# EAGLE design dbt-mini-shield (EAGLE 9.7.0)
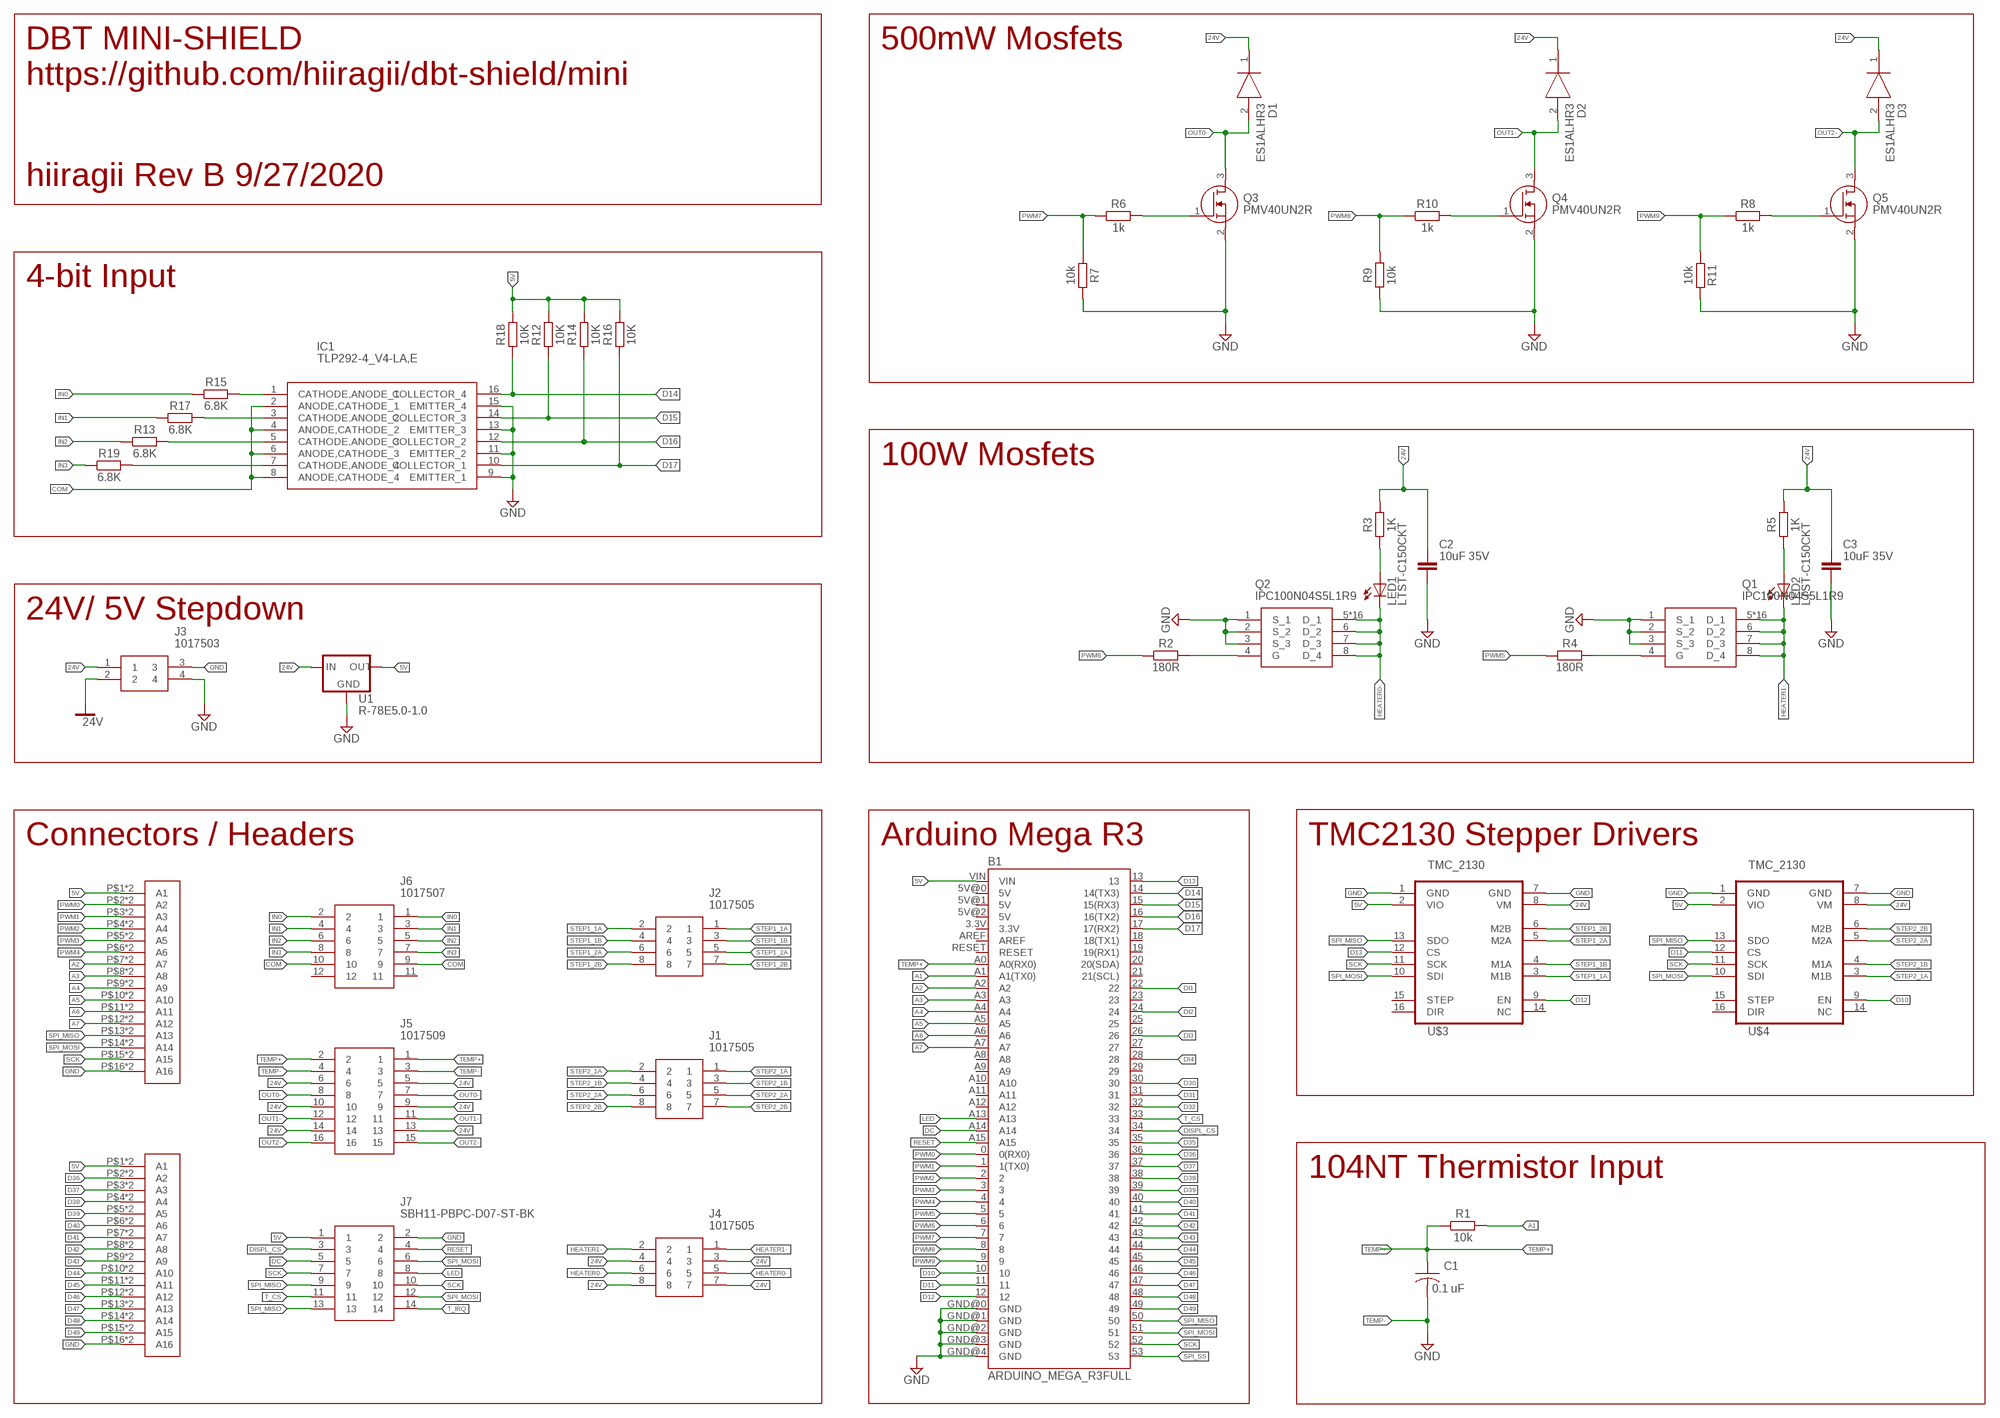
[diagram p0: schematic, sheet 1]

## Parts
B1  ARDUINO_MEGA_R3FULL  [ARDUINO_MEGA]
C1  0.1 uF  C-USC1206  [C1206]
C2  10uF 35V  C_CHIP-1206(3216-METRIC)  [CAPC3216X135]
C3  10uF 35V  C_CHIP-1206(3216-METRIC)  [CAPC3216X135]
D1  ES1ALHR3  [SODFL3618X143N]
D2  ES1ALHR3  [SODFL3618X143N]
D3  ES1ALHR3  [SODFL3618X143N]
IC1  TLP292-4_V4-LA,E  [SOIC127P700X230-16N]
J1  1017505  [1017505]
J2  1017505  [1017505]
J3  1017503  [1017503]
J4  1017505  [1017505]
J5  1017509  [1017509]
J6  1017507  [1017507]
J7  SBH11-PBPC-D07-ST-BK  [SHDR14W64P254_2X7_2528X910X910]
LED1  LTST-C150CKT  LEDCHIPLED_1206  [CHIPLED_1206]
LED2  LTST-C150CKT  LEDCHIPLED_1206  [CHIPLED_1206]
Q1  IPC100N04S5L1R9  [PG-TDSON-8]
Q2  IPC100N04S5L1R9  [PG-TDSON-8]
Q3  PMV40UN2R  [SOT95P230X110-3N]
Q4  PMV40UN2R  [SOT95P230X110-3N]
Q5  PMV40UN2R  [SOT95P230X110-3N]
R1  10k  R_CHIP-1206(3216-METRIC)  [RESC3216X70]
R2  180R  R_CHIP-1206(3216-METRIC)  [RESC3216X70]
R3  1K  R_CHIP-1206(3216-METRIC)  [RESC3216X70]
R4  180R  R_CHIP-1206(3216-METRIC)  [RESC3216X70]
R5  1K  R_CHIP-1206(3216-METRIC)  [RESC3216X70]
R6  1k  R_CHIP-1206(3216-METRIC)  [RESC3216X70]
R7  10k  R_CHIP-1206(3216-METRIC)  [RESC3216X70]
R8  1k  R_CHIP-1206(3216-METRIC)  [RESC3216X70]
R9  10k  R_CHIP-1206(3216-METRIC)  [RESC3216X70]
R10  1k  R_CHIP-1206(3216-METRIC)  [RESC3216X70]
R11  10k  R_CHIP-1206(3216-METRIC)  [RESC3216X70]
R12  10K  R_CHIP-1206(3216-METRIC)  [RESC3216X70]
R13  6.8K  R_CHIP-1206(3216-METRIC)  [RESC3216X70]
R14  10K  R_CHIP-1206(3216-METRIC)  [RESC3216X70]
R15  6.8K  R_CHIP-1206(3216-METRIC)  [RESC3216X70]
R16  10K  R_CHIP-1206(3216-METRIC)  [RESC3216X70]
R17  6.8K  R_CHIP-1206(3216-METRIC)  [RESC3216X70]
R18  10K  R_CHIP-1206(3216-METRIC)  [RESC3216X70]
R19  6.8K  R_CHIP-1206(3216-METRIC)  [RESC3216X70]
U1  R-78E5.0-1.0  [DC-DC_CONVERTER_78XX]
U$1  1861991  [1861991]
U$2  1861991  [1861991]
U$3  TMC_2130  [TMC_2130]
U$4  TMC_2130  [TMC_2130]

## Nets
5V: B1.VIN J7.1 R12.2 R14.2 R16.2 R18.2 U1.VOUT(OUT) U$1.P$1(A1) U$1.P$17(A1) U$2.P$1(A1) U$2.P$17(A1) U$3.2(VIO) U$4.2(VIO)
24V: C2.1 C3.1 D1.1(K) D2.1(K) D3.1(K) J3.1 J3.2 J4.3 J4.4 J4.7 J4.8 J5.5 J5.6 J5.9 J5.10 J5.13 J5.14 R3.2 R5.2 U1.VIN(IN) U$3.8(VM) U$4.8(VM)
A1: B1.A1(A1(TX0)) R1.2
A2: B1.A2 U$1.P$7(A7) U$1.P$23(A7)
A3: B1.A3 U$1.P$8(A8) U$1.P$24(A8)
A4: B1.A4 U$1.P$9(A9) U$1.P$25(A9)
A5: B1.A5 U$1.P$10(A10) U$1.P$26(A10)
A6: B1.A6 U$1.P$11(A11) U$1.P$27(A11)
A7: B1.A7 U$1.P$12(A12) U$1.P$28(A12)
COM: IC1.2(ANODE,CATHODE_1) IC1.4(ANODE,CATHODE_2) IC1.6(ANODE,CATHODE_3) IC1.8(ANODE,CATHODE_4) J6.9 J6.10
D10: B1.10 U$4.9(EN)
D11: B1.11 U$4.12(CS)
D12: B1.12 U$3.9(EN)
D13: B1.13 U$3.12(CS)
D14: B1.14(14(TX3)) IC1.16(COLLECTOR_4) R18.1
D15: B1.15(15(RX3)) IC1.14(COLLECTOR_3) R12.1
D16: B1.16(16(TX2)) IC1.12(COLLECTOR_2) R14.1
D17: B1.17(17(RX2)) IC1.10(COLLECTOR_1) R16.1
D30: B1.30
D31: B1.31
D32: B1.32
D35: B1.35
D36: B1.36 U$2.P$2(A2) U$2.P$18(A2)
D37: B1.37 U$2.P$3(A3) U$2.P$19(A3)
D38: B1.38 U$2.P$4(A4) U$2.P$20(A4)
D39: B1.39 U$2.P$5(A5) U$2.P$21(A5)
D40: B1.40 U$2.P$6(A6) U$2.P$22(A6)
D41: B1.41 U$2.P$7(A7) U$2.P$23(A7)
D42: B1.42 U$2.P$8(A8) U$2.P$24(A8)
D43: B1.43 U$2.P$9(A9) U$2.P$25(A9)
D44: B1.44 U$2.P$10(A10) U$2.P$26(A10)
D45: B1.45 U$2.P$11(A11) U$2.P$27(A11)
D46: B1.46 U$2.P$12(A12) U$2.P$28(A12)
D47: B1.47 U$2.P$13(A13) U$2.P$29(A13)
D48: B1.48 U$2.P$14(A14) U$2.P$30(A14)
D49: B1.49 U$2.P$15(A15) U$2.P$31(A15)
DC: B1.A14 J7.5
DI1: B1.22
DI2: B1.24
DI3: B1.26
DI4: B1.28
DISPL_CS: B1.34 J7.3
G: Q2.4(G) R2.2
G1: Q1.4(G) R4.2
GND: B1.GND@0(GND) B1.GND@1(GND) B1.GND@2(GND) B1.GND@3(GND) B1.GND@4(GND) C2.2 C3.2 IC1.9(EMITTER_1) IC1.11(EMITTER_2) IC1.13(EMITTER_3) IC1.15(EMITTER_4) J3.3 J3.4 J7.2 Q1.1(S_1) Q1.2(S_2) Q1.3(S_3) Q2.1(S_1) Q2.2(S_2) Q2.3(S_3) Q3.2(S) Q4.2(S) Q5.2(S) R7.2 R9.1 R11.2 U1.GND U$1.P$16(A16) U$1.P$32(A16) U$2.P$16(A16) U$2.P$32(A16) U$3.1(GND) U$3.7(GND) U$4.1(GND) U$4.7(GND)
HEATER0-: J4.5 J4.6 LED1.C Q2.5(D_1) Q2.6(D_2) Q2.7(D_3) Q2.8(D_4) Q2.9(D_1) Q2.P$1(D_1) Q2.P$2(D_1) Q2.P$3(D_1) Q2.P$4(D_1) Q2.P$5(D_1) Q2.P$6(D_1) Q2.P$7(D_1) Q2.P$8(D_1) Q2.P$9(D_1) Q2.P$10(D_1) Q2.P$11(D_1) Q2.P$12(D_1) Q2.P$13(D_1) Q2.P$14(D_1)
HEATER1-: J4.1 J4.2 LED2.C Q1.5(D_1) Q1.6(D_2) Q1.7(D_3) Q1.8(D_4) Q1.9(D_1) Q1.P$1(D_1) Q1.P$2(D_1) Q1.P$3(D_1) Q1.P$4(D_1) Q1.P$5(D_1) Q1.P$6(D_1) Q1.P$7(D_1) Q1.P$8(D_1) Q1.P$9(D_1) Q1.P$10(D_1) Q1.P$11(D_1) Q1.P$12(D_1) Q1.P$13(D_1) Q1.P$14(D_1)
IN0: J6.1 J6.2 R15.1
IN1: J6.3 J6.4 R17.1
IN2: J6.5 J6.6 R13.1
IN3: J6.7 J6.8 R19.1
LED: B1.A13 J7.8
N$3: LED1.A R3.1
N$5: LED2.A R5.1
N$100: IC1.1(CATHODE,ANODE_1) R15.2
N$102: IC1.3(CATHODE,ANODE_2) R17.2
N$104: IC1.5(CATHODE,ANODE_3) R13.2
N$106: IC1.7(CATHODE,ANODE_4) R19.2
N$130: Q3.1(G) R6.2
N$139: Q4.1(G) R10.2
N$141: Q5.1(G) R8.2
OUT0-: D1.2(A) J5.7 J5.8 Q3.3(D)
OUT1-: D2.2(A) J5.11 J5.12 Q4.3(D)
OUT2-: D3.2(A) J5.15 J5.16 Q5.3(D)
PWM0: B1.0(0(RX0)) U$1.P$2(A2) U$1.P$18(A2)
PWM1: B1.1(1(TX0)) U$1.P$3(A3) U$1.P$19(A3)
PWM2: B1.2 U$1.P$4(A4) U$1.P$20(A4)
PWM3: B1.3 U$1.P$5(A5) U$1.P$21(A5)
PWM4: B1.4 U$1.P$6(A6) U$1.P$22(A6)
PWM5: B1.5 R4.1
PWM6: B1.6 R2.1
PWM7: B1.7 R6.1 R7.1
PWM8: B1.8 R9.2 R10.1
PWM9: B1.9 R8.1 R11.1
RESET: B1.A15 J7.4
SCK: B1.52 J7.7 J7.10 U$1.P$15(A15) U$1.P$31(A15) U$3.11(SCK) U$4.11(SCK)
SPI_MISO: B1.50 J7.9 J7.13 U$1.P$13(A13) U$1.P$29(A13) U$3.13(SDO) U$4.13(SDO)
SPI_MOSI: B1.51 J7.6 J7.12 U$1.P$14(A14) U$1.P$30(A14) U$3.10(SDI) U$4.10(SDI)
SPI_SS: B1.53
STEP1_1A: J2.1 J2.2 U$3.3(M1B)
STEP1_1B: J2.3 J2.4 U$3.4(M1A)
STEP1_2A: J2.5 J2.6 U$3.5(M2A)
STEP1_2B: J2.7 J2.8 U$3.6(M2B)
STEP2_1A: J1.1 J1.2 U$4.3(M1B)
STEP2_1B: J1.3 J1.4 U$4.4(M1A)
STEP2_2A: J1.5 J1.6 U$4.5(M2A)
STEP2_2B: J1.7 J1.8 U$4.6(M2B)
T_CS: B1.33 J7.11
T_IRQ: J7.14
TEMP+: B1.A0(A0(RX0)) C1.1 J5.1 J5.2 R1.1
TEMP-: C1.2 J5.3 J5.4 ; supply symbol labelled GND
Unconnected: B1.3.3V B1.5V@0(5V) B1.5V@1(5V) B1.5V@2(5V) B1.18(18(TX1)) B1.19(19(RX1)) B1.20(20(SDA)) B1.21(21(SCL)) B1.23 B1.25 B1.27 B1.29 B1.A8 B1.A9 B1.A10 B1.A11 B1.A12 B1.AREF B1.RESET J6.11 J6.12 U$3.15(STEP) U$3.16(DIR) U$4.15(STEP) U$4.16(DIR)

## Notes on the sheet
- 500mW Mosfets
- DBT MINI-SHIELD
  https://github.com/hiiragii/dbt-shield/mini
- hiiragii Rev B 9/27/2020
- 4-bit Input
- 100W Mosfets
- 24V/ 5V Stepdown
- Connectors / Headers | Arduino Mega R3 | TMC2130 Stepper Drivers
- 104NT Thermistor Input

## Power pins joined to a net without a drawn wire
NC: U$3.14(NC) U$4.14(NC)

## Library data of the parts
B1 = dbt_shield:ARDUINO_MEGA_R3: Arduino Mega R3 ATmega2560 R3 compatible footprint. SparkFun Products: Arduino Mega 2560 R3 <https://www.sparkfun.com/products/11061>
C1 = adafruit:C-US: CAPACITOR, American symbol
C2 C3 = Capacitor:C: Capacitor - Generic; CATEGORY: Capacitor
D1-D3 = dbt_shield:ES1ALHR3: Rectifiers 1A, 50V, SUPER FAST SM RECTIFIER Source: Datasheet <https://componentsearchengine.com/Datasheets/1/ES1ALHR3.pdf>; DESCRIPTION: Rectifiers 1A, 50V, SUPER FAST SM RECTIFIER; HEIGHT: 1.43mm; MANUFACTURER_NAME: Taiwan Semiconductor; MANUFACTURER_PART_NUMBER: ES1ALHR3; MOUSER_PART_NUMBER: 821-ES1ALHR3; MOUSER_PRICE-STOCK: https://www.mouser.co.uk/ProductDetail/Taiwan-Semiconductor/ES1ALHR3?qs=70cth9uAySfs%2F8RIhd19cA%3D%3D
IC1 = dbt_shield:TLP292-4_V4-LA,E: Transistor Output Optocouplers 4ch Transistor opto coupler Source: Datasheet <https://toshiba.semicon-storage.com/info/docget.jsp?did=15284&prodName=TLP292-4>; DESCRIPTION: Transistor Output Optocouplers 4ch Transistor opto coupler; HEIGHT: 2.3mm; MANUFACTURER_NAME: Toshiba; MANUFACTURER_PART_NUMBER: TLP292-4(V4-LA,E; MOUSER_PART_NUMBER: 757-TLP292-4V4-LAE; MOUSER_PRICE-STOCK: https://www.mouser.com/Search/Refine.aspx?Keyword=757-TLP292-4V4-LAE
J1 J2 J4 = dbt_shield:1017505: Phoenix Contact TDPT Series 5.08mm Pitch, PCB Terminal Block, PCB Mount, 4 Way Source: Datasheet <https://www.phoenixcontact.com/online/portal/gb/?uri=pxc-oc-itemdetail:pid=1017505&library=gben&pcck=P-11-01-05&tab=1&selectedCategory=ALL>; ALLIED_NUMBER: 71241694; ALLIED_PRICE-STOCK: https://www.alliedelec.com/phoenixcontact-1017505/71241694/; DESCRIPTION: Phoenix Contact TDPT Series 5.08mm Pitch, PCB Terminal Block, PCB Mount, 4 Way; HEIGHT: 19.2mm; MANUFACTURER_NAME: Phoenix Contact; MANUFACTURER_PART_NUMBER: 1017505; MOUSER_PART_NUMBER: 651-1017505; MOUSER_PRICE-STOCK: https://www.mouser.com/Search/Refine.aspx?Keyword=651-1017505; RS_PART_NUMBER: 1753922; RS_PRICE-STOCK: http://uk.rs-online.com/web/p/products/1753922
J3 = dbt_shield:1017503: Phoenix Contact TDPT Series 5.08mm Pitch, PCB Terminal Block, PCB Mount, 2 Way Source: Datasheet <https://www.phoenixcontact.com/online/portal/gb?uri=pxc-oc-itemdetail:pid=1017503&library=gben&tab=1>; ARROW_PART_NUMBER: 1017503; ARROW_PRICE-STOCK: https://www.arrow.com/en/products/1017503/phoenix-contact; DESCRIPTION: Phoenix Contact TDPT Series 5.08mm Pitch, PCB Terminal Block, PCB Mount, 2 Way; HEIGHT: 19.2mm; MANUFACTURER_NAME: Phoenix Contact; MANUFACTURER_PART_NUMBER: 1017503; MOUSER_PART_NUMBER: 651-1017503; MOUSER_PRICE-STOCK: https://www.mouser.co.uk/ProductDetail/Phoenix-Contact/1017503?qs=F5EMLAvA7ICurcWsoxF7Hw%3D%3D
J5 = dbt_shield:1017509: Phoenix Contact TDPT Series 5.08mm Pitch, PCB Terminal Block, PCB Mount, 8 Way Source: Datasheet <https://www.phoenixcontact.com/online/portal/gb?uri=pxc-oc-itemdetail:pid=1017509&library=gben&tab=1>; ALLIED_NUMBER: 71241695; ALLIED_PRICE-STOCK: https://www.alliedelec.com/phoenixcontact-1017509/71241695/; DESCRIPTION: Phoenix Contact TDPT Series 5.08mm Pitch, PCB Terminal Block, PCB Mount, 8 Way; HEIGHT: 19.2mm; MANUFACTURER_NAME: Phoenix Contact; MANUFACTURER_PART_NUMBER: 1017509; MOUSER_PART_NUMBER: 651-1017509; MOUSER_PRICE-STOCK: https://www.mouser.com/Search/Refine.aspx?Keyword=651-1017509; RS_PART_NUMBER: 1753943P; RS_PRICE-STOCK: http://uk.rs-online.com/web/p/products/1753943P
J6 = dbt_shield:1017507: Phoenix Contact TDPT Series 5.08mm Pitch, PCB Terminal Block, PCB Mount, 6 Way Source: Datasheet <https://www.arrow.com/en/products/1017507/phoenix-contact>; DESCRIPTION: Phoenix Contact TDPT Series 5.08mm Pitch, PCB Terminal Block, PCB Mount, 6 Way; HEIGHT: 19.2mm; MANUFACTURER_NAME: Phoenix Contact; MANUFACTURER_PART_NUMBER: 1017507; MOUSER_PART_NUMBER: 651-1017507; MOUSER_PRICE-STOCK: https://www.mouser.com/Search/Refine.aspx?Keyword=651-1017507
J7 = SBH11-PBPC-D07-ST-BK:SBH11-PBPC-D07-ST-BK: CONN HEADER VERT 14POS 2.54MM Source: Datasheet <https://drawings-pdf.s3.amazonaws.com/11091.pdf>; ARROW_PART_NUMBER: SBH11-PBPC-D07-ST-BK; DESCRIPTION: CONN HEADER VERT 14POS 2.54MM; HEIGHT: 9.1mm; MANUFACTURER_NAME: Sullins; MANUFACTURER_PART_NUMBER: SBH11-PBPC-D07-ST-BK
LED1 = dbt_shield:LED: LED OSRAM: - CHIPLED LG R971, LG N971, LY N971, LG Q971, LY Q971, LO R971, LY R971 LH N974, LH R974 LS Q976, LO Q976, LY Q976 LO Q996 - Hyper CHIPLED LW Q18S LB Q993, LB Q99A, LB R99A - SideLED LS A670, LO A670, LY A670, LG A670, LP A670 LB A673, LV A673, LT A673, LW A673 LH A674 LY A675 LS A676, LA A676, LO A676, LY A676, LW A676 LS A679, LY A679, LG A679 - Hyper Micro SIDELED® LS Y876, LA Y876, LO Y876, LY Y876 LT Y87S - SmartLED LW L88C, LW L88S LB L89C, LB L89S, LG L890 LS L89K, LO L89K, LY L89K LS L896, LA L896, LO L896, LY L896 - TOPLED LS T670, LO T670, LY T670, LG T670, LP T670 LSG T670, LSP T670, LSY T670, LOP T670, LYG T670 LG T671, LOG T671, LSG T671 LB T673, LV T673, LT T673, LW T673 LH T674 LS T676, LA T676, LO T676, LY T676, LB T676, LH T676, LSB T676, LW T676 LB T67C, LV T67C, LT T67C, LS T67K, LO T67K, LY T67K, LW E67C LS E67B, LA E67B, LO E67B, LY E67B, LB E67C, LV E67C, LT E67C LW T67C LS T679, LY T679, LG T679 LS T770, LO T770, LY T770, LG T770, LP T770 LB T773, LV T773, LT T773, LW T773 LH T774 LS E675, LA E675, LY E675, LS T675 LS T776, LA T776, LO T776, LY T776, LB T776 LHGB T686 LT T68C, LB T68C - Hyper Mini TOPLED® LB M676 - Mini TOPLED Santana® LG M470 LS M47K, LO M47K, LY M47K Source: http://www.osram.convergy.de/; SPICEPREFIX: D
LED2 = dbt_shield:LED: LED OSRAM: - CHIPLED LG R971, LG N971, LY N971, LG Q971, LY Q971, LO R971, LY R971 LH N974, LH R974 LS Q976, LO Q976, LY Q976 LO Q996 - Hyper CHIPLED LW Q18S LB Q993, LB Q99A, LB R99A - SideLED LS A670, LO A670, LY A670, LG A670, LP A670 LB A673, LV A673, LT A673, LW A673 LH A674 LY A675 LS A676, LA A676, LO A676, LY A676, LW A676 LS A679, LY A679, LG A679 - Hyper Micro SIDELED® LS Y876, LA Y876, LO Y876, LY Y876 LT Y87S - SmartLED LW L88C, LW L88S LB L89C, LB L89S, LG L890 LS L89K, LO L89K, LY L89K LS L896, LA L896, LO L896, LY L896 - TOPLED LS T670, LO T670, LY T670, LG T670, LP T670 LSG T670, LSP T670, LSY T670, LOP T670, LYG T670 LG T671, LOG T671, LSG T671 LB T673, LV T673, LT T673, LW T673 LH T674 LS T676, LA T676, LO T676, LY T676, LB T676, LH T676, LSB T676, LW T676 LB T67C, LV T67C, LT T67C, LS T67K, LO T67K, LY T67K, LW E67C LS E67B, LA E67B, LO E67B, LY E67B, LB E67C, LV E67C, LT E67C LW T67C LS T679, LY T679, LG T679 LS T770, LO T770, LY T770, LG T770, LP T770 LB T773, LV T773, LT T773, LW T773 LH T774 LS E675, LA E675, LY E675, LS T675 LS T776, LA T776, LO T776, LY T776, LB T776 LHGB T686 LT T68C, LB T68C - Hyper Mini TOPLED® LB M676 - Mini TOPLED Santana® LG M470 LS M47K, LO M47K, LY M47K Source: http://www.osram.convergy.de/
Q1 = dbt_shield:IPC100N04S5L1R9: BSC082N10LSGATMA1 N-Channel MOSFET, 100 A, 100 V OptiMOS 2, 8-Pin TDSON Infineon Source: Datasheet <https://www.infineon.com/dgdl/Infineon-BSC082N10LS-DS-v01_07-en.pdf?fileId=db3a3043163797a6011647faad240719>; ARROW_PART_NUMBER: BSC082N10LSGATMA1; ARROW_PRICE-STOCK: https://www.arrow.com/en/products/bsc082n10lsgatma1/infineon-technologies-ag; DESCRIPTION: BSC082N10LSGATMA1 N-Channel MOSFET, 100 A, 100 V OptiMOS 2, 8-Pin TDSON Infineon; HEIGHT: mm; MANUFACTURER_NAME: Infineon; MANUFACTURER_PART_NUMBER: BSC082N10LSGATMA1; MOUSER_PART_NUMBER: N/A; MOUSER_PRICE-STOCK: https://www.mouser.com/Search/Refine.aspx?Keyword=N%2FA
Q2 = dbt_shield:IPC100N04S5L1R9: BSC082N10LSGATMA1 N-Channel MOSFET, 100 A, 100 V OptiMOS 2, 8-Pin TDSON Infineon Source: Datasheet <https://www.infineon.com/dgdl/Infineon-BSC082N10LS-DS-v01_07-en.pdf?fileId=db3a3043163797a6011647faad240719>; ARROW_PART_NUMBER: BSC082N10LSGATMA1; ARROW_PRICE-STOCK: https://www.arrow.com/en/products/bsc082n10lsgatma1/infineon-technologies-ag; DESCRIPTION: BSC082N10LSGATMA1 N-Channel MOSFET, 100 A, 100 V OptiMOS 2, 8-Pin TDSON Infineon; HEIGHT: mm; MANUFACTURER_NAME: Infineon; MANUFACTURER_PART_NUMBER: BSC082N10LSGATMA1; MOUSER_PART_NUMBER: N/A; MOUSER_PRICE-STOCK: https://www.mouser.com/Search/Refine.aspx?Keyword=N%2FA; SPICEPREFIX: X
Q3-Q5 = dbt_shield:PMV40UN2R: MOSFET 30V N-channel Trench MOSFET Source: Datasheet <http://assets.nexperia.com/documents/data-sheet/PMV40UN2.pdf>; DESCRIPTION: MOSFET 30V N-channel Trench MOSFET; HEIGHT: 1.1mm; MANUFACTURER_NAME: Nexperia; MANUFACTURER_PART_NUMBER: PMV40UN2R; MOUSER_PART_NUMBER: 771-PMV40UN2R; MOUSER_PRICE-STOCK: https://www.mouser.co.uk/ProductDetail/Nexperia/PMV40UN2R?qs=sV%252BQJnSpgu%2Ftc99QGRzcMg%3D%3D; RS_PART_NUMBER: 1362196P; RS_PRICE-STOCK: http://uk.rs-online.com/web/p/products/1362196P
R1-R19 = Resistor:R: Resistor Fixed - Generic; CATEGORY: Resistor; SUB-CATEGORY: Fixed
U1 = dbt_shield:R-78E5.0-1.0: Recom Power 5V 1A DC/DC Converter The Recom R-78E5.0-X.X is a compact DC/DC converter module that is a pin for pin drop-in replacement for the LM7805 linear voltage regulator. Specifications: Input Range: 7-28V Output Voltage: 5V Output Current: 1A Max Efficiency: 91% Datasheet <https://www.recom-power.com/pdf/Innoline/R-78Exx-1.0.pdf>; PROD_ID: COM-13655
U$1 U$2 = dbt_shield:1861991
U$3 U$4 = dbt_shield:TMC_2130

## Board
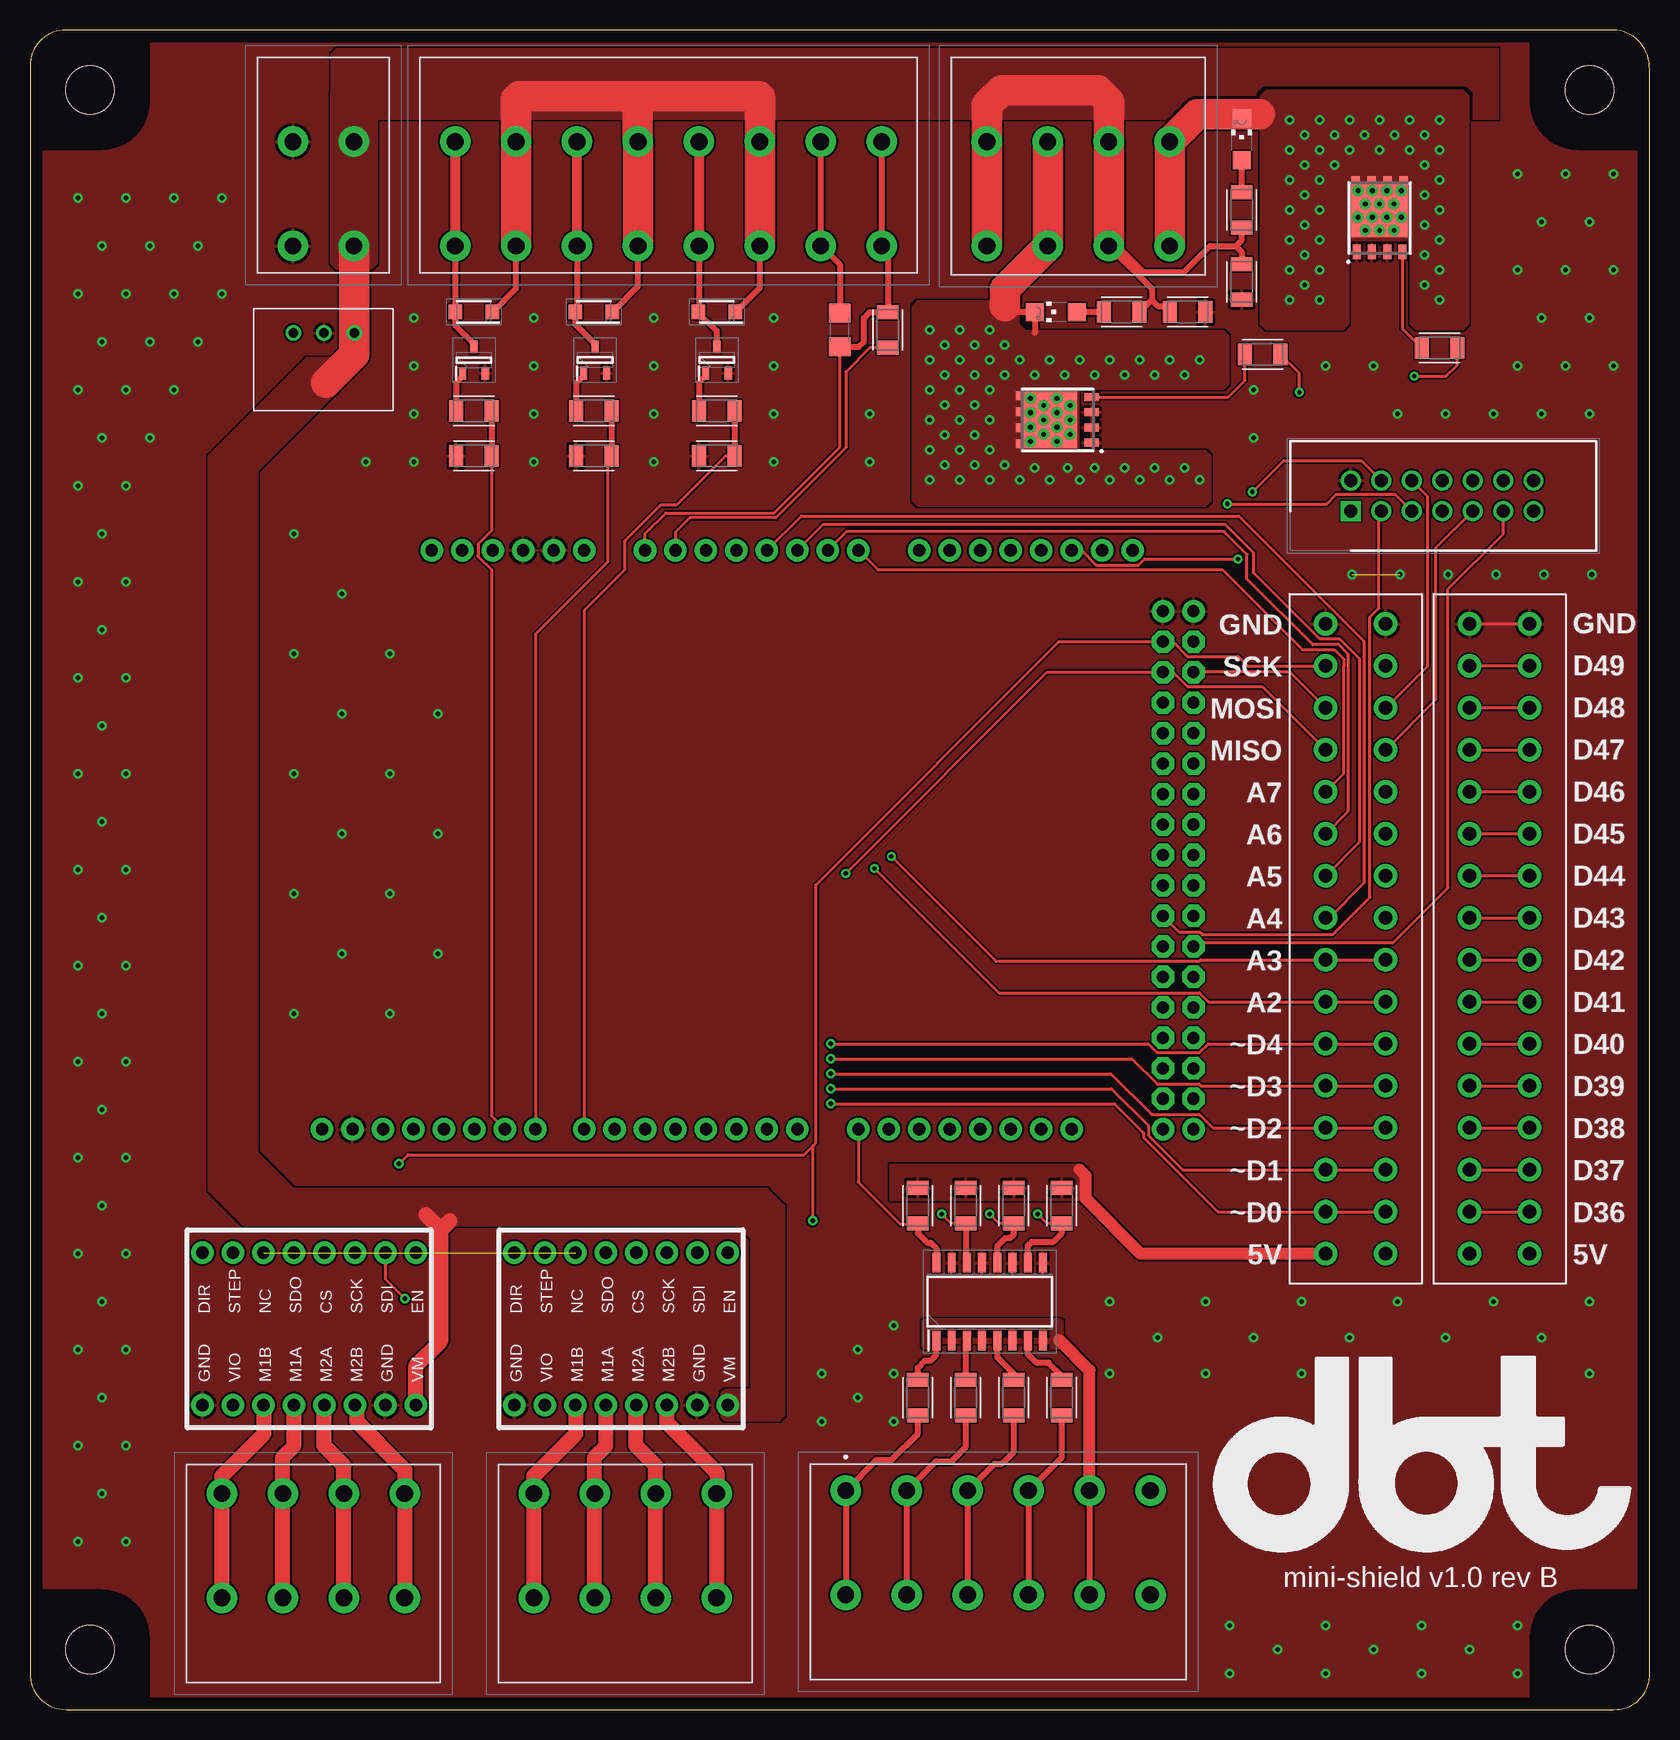
[diagram p1: board, top side]
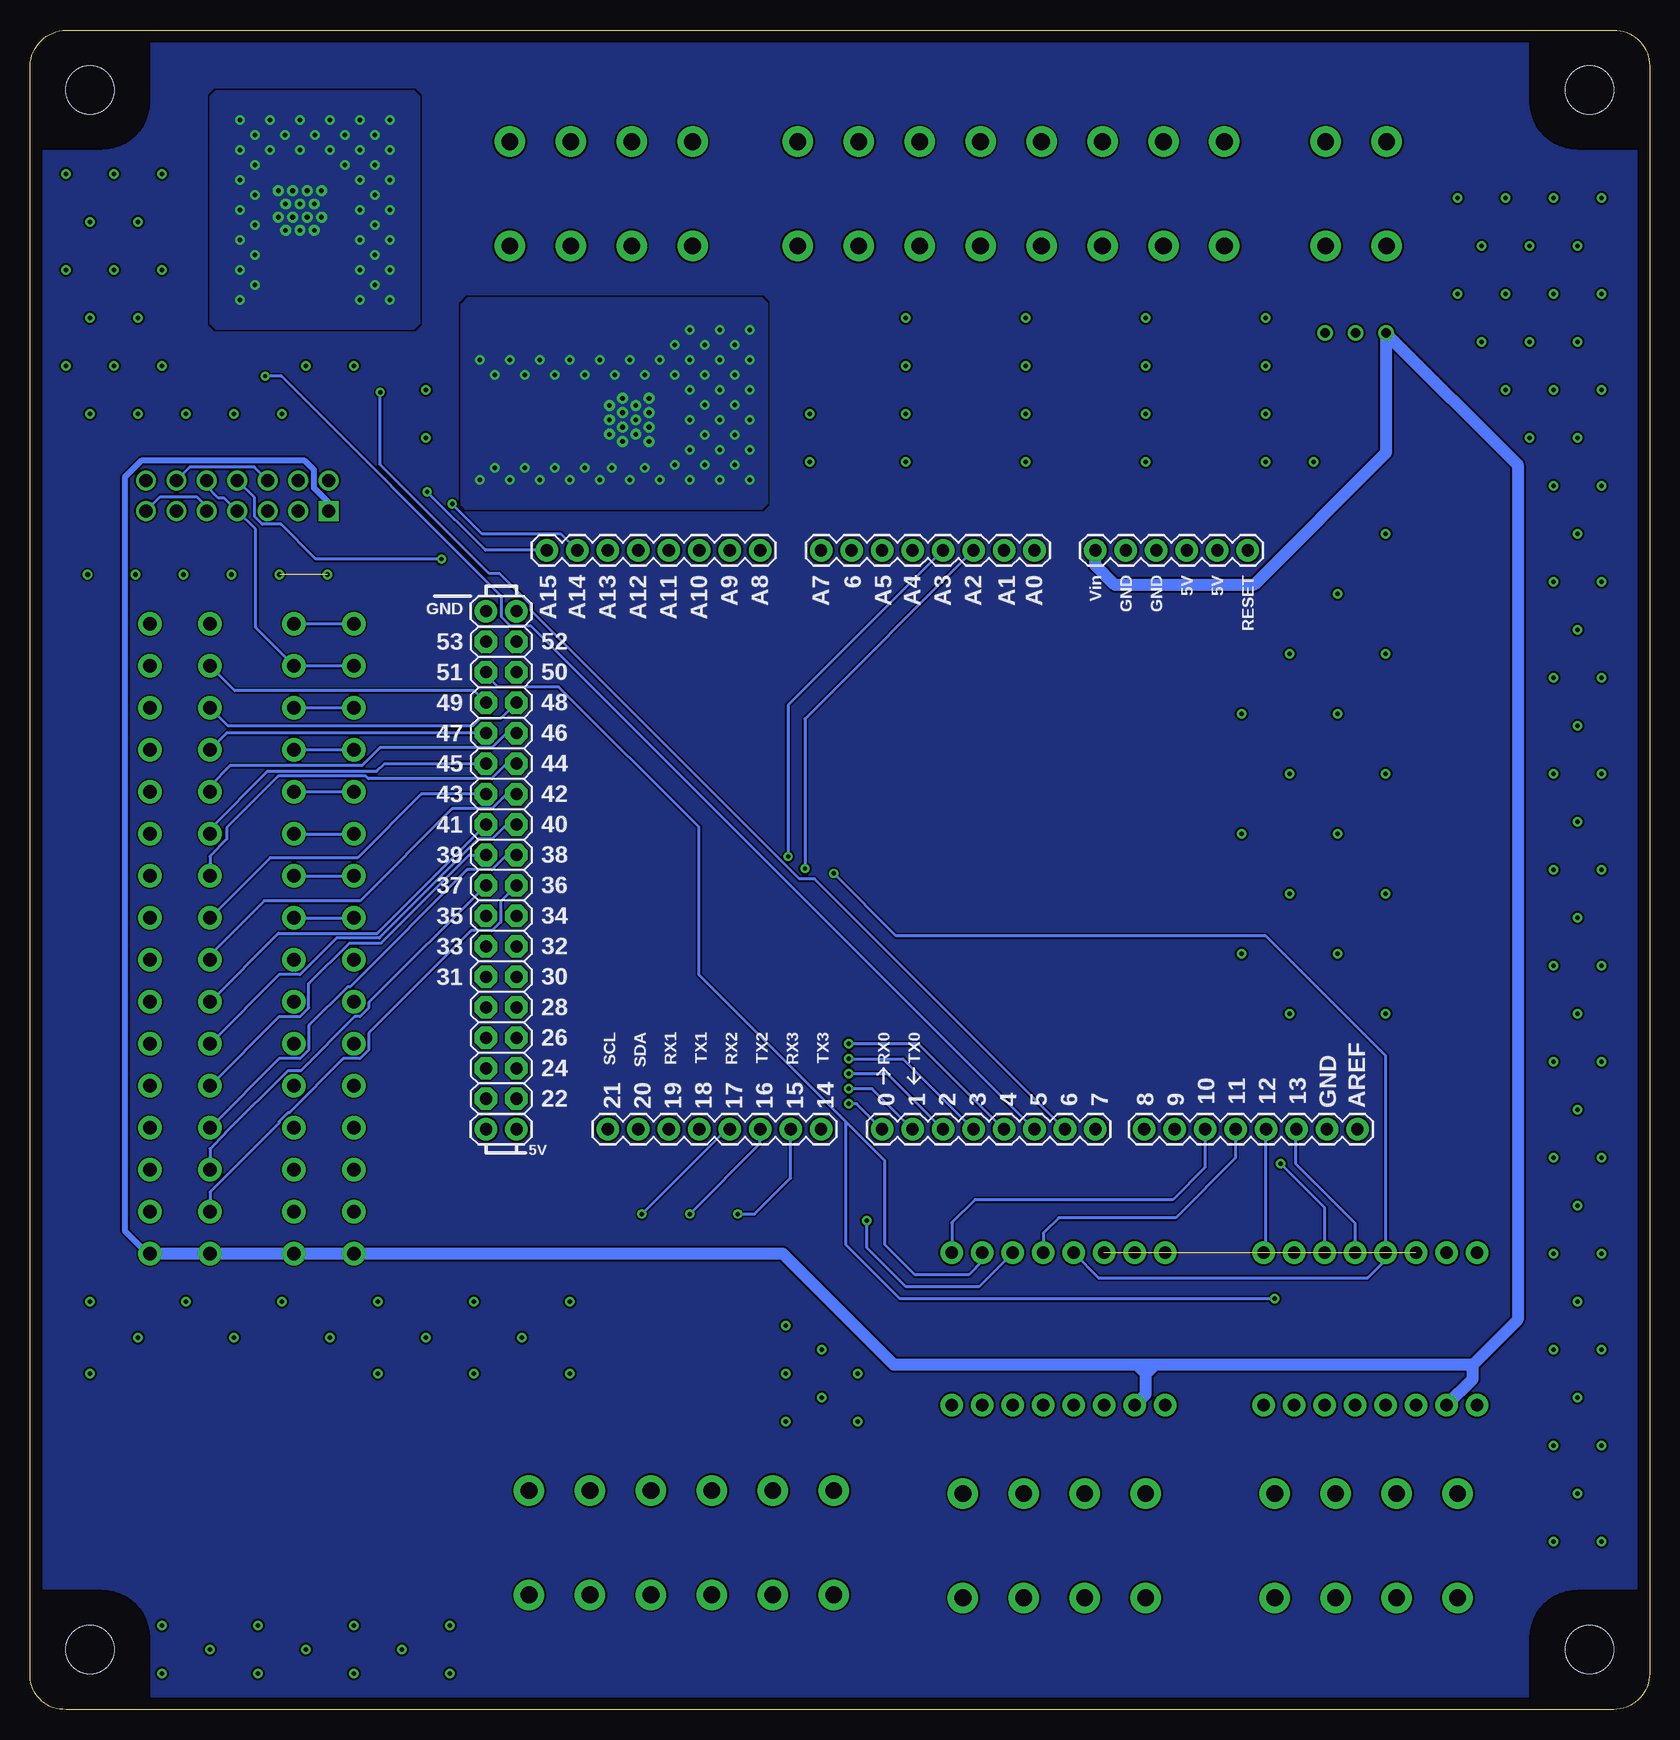
[diagram p2: board, bottom side, seen from below]

Size 135 x 140 mm. Coordinates in mm from the lower left corner, seen from the top.
Outline: 0,137 0,3 arc90 3,0 132,0 arc90 135,2.75 135,136.75 arc90 132,140 3,140 arc90 0,137
Copper layers (1*16): Top 0.035mm / dielectric 1.5mm / Bottom 0.035mm
Design rules "default *": minimum track width 6mil, minimum drill 0.35mm, track to track 6mil, track to pad 6mil, pad to pad 6mil, via to via 6mil, smd to smd 6mil, copper to edge 40mil, drill to drill 6mil, minimum pad ring 10mil, minimum via ring 8mil, stop-mask expansion 4mil, vias tented up to drill 0mil, thermal gap 10mil
Holes 4 mm at 130,135 130,5 5,5 5,135
tRestrict: area -1.9,130.1 to 9.9,141.9; area -1.9,0.1 to 9.9,9.9; area 125.1,-1.9 to 135.9,9.9; area 125.1,130.1 to 135.9,141.9
bRestrict: area -1.9,130.1 to 9.9,141.9; area -1.9,0.1 to 9.9,9.9; area 125.1,-1.9 to 135.9,9.9; area 125.1,130.1 to 135.9,141.9

### Footprints (pad centres in the part's own frame; a part is rotated, then mirrored left to right if it is on the bottom)
ARDUINO_MEGA = drill 1.016 pad 1.88: 0 13.97,24.13; 1 11.43,24.13; 2 8.89,24.13; 3 6.35,24.13; 3.3V -13.97,-24.13; 4 3.81,24.13; 5 1.27,24.13; 5V@0 -11.43,-24.13; 5V@1 44.45,24.13; 5V@2 46.99,24.13; 6 -1.27,24.13; 7 -3.81,24.13; 8 -7.874,24.13; 9 -10.414,24.13; 10 -12.954,24.13; 11 -15.494,24.13; 12 -18.034,24.13; 13 -20.574,24.13; 14 19.05,24.13; 15 21.59,24.13; 16 24.13,24.13; 17 26.67,24.13; 18 29.21,24.13; 19 31.75,24.13; 20 34.29,24.13; 21 36.83,24.13; A0 1.27,-24.13; A1 3.81,-24.13; A2 6.35,-24.13; A3 8.89,-24.13; A4 11.43,-24.13; A5 13.97,-24.13; A6 16.51,-24.13; A7 19.05,-24.13; A8 24.13,-24.13; A9 26.67,-24.13; A10 29.21,-24.13; A11 31.75,-24.13; A12 34.29,-24.13; A13 36.83,-24.13; A14 39.37,-24.13; A15 41.91,-24.13; AREF -25.654,24.13; GND@0 -8.89,-24.13; GND@1 -6.35,-24.13; GND@2 44.45,-19.05; GND@3 46.99,-19.05; GND@4 -23.114,24.13; RESET -16.51,-24.13; VIN -3.81,-24.13 | drill 1.016 pad 1.88 octagon: 22 44.45,21.59; 23 46.99,21.59; 24 44.45,19.05; 25 46.99,19.05; 26 44.45,16.51; 27 46.99,16.51; 28 44.45,13.97; 29 46.99,13.97; 30 44.45,11.43; 31 46.99,11.43; 32 44.45,8.89; 33 46.99,8.89; 34 44.45,6.35; 35 46.99,6.35; 36 44.45,3.81; 37 46.99,3.81; 38 44.45,1.27; 39 46.99,1.27; 40 44.45,-1.27; 41 46.99,-1.27; 42 44.45,-3.81; 43 46.99,-3.81; 44 44.45,-6.35; 45 46.99,-6.35; 46 44.45,-8.89; 47 46.99,-8.89; 48 44.45,-11.43; 49 46.99,-11.43; 50 44.45,-13.97; 51 46.99,-13.97; 52 44.45,-16.51; 53 46.99,-16.51
C1206 = smd 1.6 x 1.8: 1 -1.4,0; 2 1.4,0
CAPC3216X135 = smd 1.165 x 1.815: 1 -1.475,0; 2 1.475,0
SODFL3618X143N = smd 1.12 x 1.22: 1 -1.55,0; 2 1.55,0
SOIC127P700X230-16N = smd 1.65 x 0.65: 1 -3.25,4.445; 2 -3.25,3.175; 3 -3.25,1.905; 4 -3.25,0.635; 5 -3.25,-0.635; 6 -3.25,-1.905; 7 -3.25,-3.175; 8 -3.25,-4.445; 9 3.25,-4.445; 10 3.25,-3.175; 11 3.25,-1.905; 12 3.25,-0.635; 13 3.25,0.635; 14 3.25,1.905; 15 3.25,3.175; 16 3.25,4.445
1017505 = drill 1.4 pad 2.54: 1 0,0; 2 0,-8.7; 3 5.08,0; 4 5.08,-8.7; 5 10.16,0; 6 10.16,-8.7; 7 15.24,0; 8 15.24,-8.7
1017503 = drill 1.4 pad 2.54: 1 0,0; 2 0,-8.7; 3 5.08,0; 4 5.08,-8.7
1017509 = drill 1.4 pad 2.54: 1 0,0; 2 0,-8.7; 3 5.08,0; 4 5.08,-8.7; 5 10.16,0; 6 10.16,-8.7; 7 15.24,0; 8 15.24,-8.7; 9 20.32,0; 10 20.32,-8.7; 11 25.4,0; 12 25.4,-8.7; 13 30.48,0; 14 30.48,-8.7; 15 35.56,0; 16 35.56,-8.7
1017507 = drill 1.4 pad 2.54: 1 0,0; 2 0,-8.7; 3 5.08,0; 4 5.08,-8.7; 5 10.16,0; 6 10.16,-8.7; 7 15.24,0; 8 15.24,-8.7; 9 20.32,0; 10 20.32,-8.7; 11 25.4,0; 12 25.4,-8.7
SHDR14W64P254_2X7_2528X910X910 = drill 1.1 pad 1.65 square: 1 0,0 | drill 1.1 pad 1.65: 2 0,2.54; 3 2.54,0; 4 2.54,2.54; 5 5.08,0; 6 5.08,2.54; 7 7.62,0; 8 7.62,2.54; 9 10.16,0; 10 10.16,2.54; 11 12.7,0; 12 12.7,2.54; 13 15.24,0; 14 15.24,2.54
CHIPLED_1206 = smd 1.5 x 1.5: A 0,-1.75; C 0,1.75
PG-TDSON-8 = smd 0.65 x 1.2: 1 -1.905,-6; 2 -0.635,-6; 3 0.635,-6; 4 1.905,-6 | smd 0.7 x 0.6: 5 2,0; 6 0.665,0; 7 -0.665,0; 8 -2,0 | smd 4.7 x 4.5: 9 0,-2.5 | drill 0.4: P$1 -1.8,-0.9; P$2 -0.6,-0.9; P$3 0.6,-0.9; P$4 1.8,-0.9; P$5 -1.8,-3.1; P$6 -0.6,-3.1; P$7 0.6,-3.1; P$8 1.8,-3.1; P$9 -1.2,-2; P$10 0,-2; P$11 1.2,-2; P$12 -1.2,-4.2; P$13 0,-4.2; P$14 1.2,-4.2
SOT95P230X110-3N = smd 1.05 x 0.6: 1 -1.1,0.95; 2 -1.1,-0.95; 3 1.1,0
RESC3216X70 = smd 1.165 x 1.815: 1 -1.475,0; 2 1.475,0
DC-DC_CONVERTER_78XX = drill 0.8: GND 0,0; VIN -2.54,0; VOUT 2.54,0
1861991 = drill 1.1 pad 1.93: P$1 0,0; P$2 3.5,0; P$3 7,0; P$4 10.5,0; P$5 14,0; P$6 17.5,0; P$7 21,0; P$8 24.5,0; P$9 28,0; P$10 31.5,0; P$11 35,0; P$12 38.5,0; P$13 42,0; P$14 45.5,0; P$15 49,0; P$16 52.5,0; P$17 0,5; P$18 3.5,5; P$19 7,5; P$20 10.5,5; P$21 14,5; P$22 17.5,5; P$23 21,5; P$24 24.5,5; P$25 28,5; P$26 31.5,5; P$27 35,5; P$28 38.5,5; P$29 42,5; P$30 45.5,5; P$31 49,5; P$32 52.5,5
TMC_2130 = drill 1.016 pad 1.88: 1 -7.62,7.62; 2 -7.62,5.08; 3 -7.62,2.54; 4 -7.62,0; 5 -7.62,-2.54; 6 -7.62,-5.08; 7 -7.62,-7.62; 8 -7.62,-10.16; 9 5.08,-10.16; 10 5.08,-7.62; 11 5.08,-5.08; 12 5.08,-2.54; 13 5.08,0; 14 5.08,2.54; 15 5.08,5.08; 16 5.08,7.62

### Placement (x,y rotation side)
B1  50,72.5 180 bottom
C1  67.5,115 90 top
C2  96.5,116.5 0 top
C3  101,119 270 top
D1  57.25,116.5 180 top
D2  47,116.5 180 top
D3  37,116.5 180 top
IC1  80,34 90 top
J1  42,18 0 top
J2  16,18 0 top
J3  27,122 180 top
J4  95,122 180 top
J5  71,122 180 top
J6  68,18.25 0 top
J7  110.1,99.9 0 top
LED1  85.5,116.5 90 top
LED2  101,130.9 0 top
Q1  112.5,127.5 0 top
Q2  82.5,107.5 90 top
Q3  57.25,112.5 90 top
Q4  47.1,112.5 90 top
Q5  37.01,112.48 90 top
R1  71.5,115 270 top
R2  102.75,112.95 180 top
R3  91,116.5 0 top
R4  117.5,113.5 180 top
R5  101,125 270 top
R6  57.25,108.25 180 top
R7  57.25,104.5 180 top
R8  37,108.25 180 top
R9  47,104.5 0 top
R10  47,108.25 180 top
R11  37,104.5 180 top
R12  78,42 90 top
R13  82,26 90 top
R14  82,42 90 top
R15  74,26 90 top
R16  86,42 90 top
R17  78,26 90 top
R18  74,42 90 top
R19  86,26 90 top
U1  24.5,114.75 180 top
U$1  113,38 90 top
U$2  125,38 90 top
U$3  22,33 90 top
U$4  48,33 90 top

### Tracks (layer width: path | path; a pad name or v marks a point on that pad's centre or on a via)
5V
  Top 1.016: U$1.P$17 92.6,38 88,42.6 88,44.5 87.5,45
  Bottom 0.508: U$2.P$1 125.2,38 127.1,39.9 127.1,102.72 125.72,104.1 112.1,104.1 111.33,103.33 111.33,101.83 110.1,100.6 J7.1
  Bottom 1.016: B1.VIN 46.19,95.38 44.56,93.75 33,93.75 21.96,104.79 U1.VOUT 11,103.79 11,32.5 14.75,28.75 | 14.75,28.75 41.25,28.75 | 41.25,28.75 42.75,28.75 | 42.75,28.75 63,28.75 72.25,38 U$1.P$17 U$1.P$1 U$2.P$17 U$2.P$1 | U$3.2 14.75,27.55 14.75,28.75 | U$4.2 42,26.3 42,28 | 42,28 41.25,28.75 | 42,28 42.75,28.75
  pour Top: 71.73,42.53 87.57,42.53 87.57,45.37 71.73,45.37
24V
  Top 0.508: 100.5,122 101,122.5 R5.2 | 100.5,122 101,121.5 C3.1 | 100.5,122 98.37,122 96.19,119.82 92.81,119.82 90.63,122 J4.3 93.5,118.42 93.5,117.53 | 93.5,117.53 R3.2 | 93.5,117.53 93.5,117.5 94,117 95,117 95.03,116.97 C2.1 | D3.1 40.52,118.47 J5.13 | D2.1 50.68,118.63 J5.9 | D1.1 60.84,118.54 J5.5
  Top 1.27: U$3.8 32.16,28.66 34.25,30.75 34.25,40 | 34.25,40 33,41.25 | 34.25,40 35,40.75
  Top 2.54: J4.3 J4.4 89.92,134.08 89,135 81,135 79.76,133.76 J4.8 J4.7 | J5.13 J5.14 40.52,134.27 40.75,134.5 50.5,134.5 | J5.9 J5.10 50.65,130.73 50.65,134.35 50.5,134.5 | J5.5 J5.6 60.84,134.41 60.75,134.5 50.5,134.5 | J3.1 27.04,121.96 U1.VIN 27.04,112.94 24.7,110.6
  pour Top (isolate 0.254, rank 3, no thermals): 25.13,132.63 122.37,132.63 122.37,138.37 25.55,138.37 25.13,137.95
  pour Top (rank 3, no thermals): 25.63,120.3 28.37,120.3 28.7,120.63 28.7,134.7 25.3,134.7 25.3,120.63
  pour Top (no thermals): 60.11,39.32 60.13,39.28 60.13,24.13 62.45,24.13 62.87,24.55 62.87,41.95 61.45,43.37 21.97,43.37 21.93,43.39 18.94,46.38 18.92,46.42 18.92,103.23 18.94,103.27 27.87,112.2 27.96,112.62 23.05,112.62 14.88,104.45 14.88,43.3 17.8,40.38 59.03,40.38 59.07,40.36
  pour Top (no thermals): 58.13,24.64 60.37,24.64 60.37,25.99 60.24,26.11 58.13,26.11
A1
  Top 0.254: B1.A1 53.81,98.13 55.02,99.34 62.17,99.34 68,105.17 68,111.5 70.03,113.53 R1.2
A2  (via drill 0.35)
  Top 0.254: v70.4,70.1 80.75,59.75 97.5,59.75 98.24,59 U$1.P$23 U$1.P$7
  Bottom 0.254: B1.A2 70.4,82.58 v70.4,70.1
A3  (via drill 0.35)
  Top 0.254: v71.8,71.1 80.51,62.39 97.5,62.39 97.6,62.5 U$1.P$24 U$1.P$8
  Bottom 0.254: B1.A3 71.8,83.72 v71.8,71.1
A4
  Top 0.254: B1.A4 64.3,99.5 100.76,99.5 111.21,89.05 111.21,68.91 108.3,66 U$1.P$25
  Bottom 0.254: U$1.P$9 U$1.P$25
A5
  Top 0.254: B1.A5 66.14,98.8 99.61,98.8 101.96,96.44 101.96,94.78 107.48,89.25 109.15,89.25 110.8,87.61 110.8,72.3 U$1.P$26
  Bottom 0.254: U$1.P$10 U$1.P$26
A6
  Top 0.254: B1.A6 68.08,98.2 99.53,98.2 101.46,96.27 101.46,94.21 106.92,88.75 109.08,88.75 109.91,87.92 109.91,74.91 U$1.P$27
  Bottom 0.254: U$1.P$11 U$1.P$27
A7
  Top 0.254: U$1.P$28 109.3,77.8 109.5,78 109.5,86.96 109.5,87.56 108.72,88.34 106.06,88.34 99.4,95 70.68,95 B1.A7
  Bottom 0.254: U$1.P$28 U$1.P$12
COM
  Top 0.508: J6.9 J6.10
  Top 1.016: J6.9 88.32,28.28 85.8,30.8
  pour Top: 74.61,30.25 85.95,30.25 85.95,32.24 85.84,32.35 74.61,32.35 74.51,32.24 74.51,30.36
D10
  Bottom 0.254: B1.10 37.05,45.2 39.75,42.5 56.25,42.5 58.16,40.59 U$4.9
D11
  Bottom 0.254: B1.11 34.51,45.99 39.5,41 49.25,41 50.54,39.71 U$4.12
D12
  Bottom 0.254: B1.12 31.97,38.27 U$3.9
D13
  Bottom 0.254: U$3.12 24.54,40.54 29.5,45.5 29.5,48.3 B1.13
D14
  Top 0.254: B1.14 69.05,43.95 72.5,40.5 73.97,40.5 R18.1
  Top 0.508: R18.1 74,39.7 74.8,38.9 75.1,38.9 75.56,38.45 IC1.16
D15  (via drill 0.35)
  Top 0.254: R12.1 76.78,40.52 v76,41.3
  Top 0.508: R12.1 78,37.34 IC1.14
  Bottom 0.254: v76,41.3 74.6,41.3 71.59,44.31 B1.15
D16  (via drill 0.35)
  Top 0.254: R14.1 80.78,40.52 v80,41.3
  Top 0.508: IC1.12 80.64,38.63 81.3,39.3 81.7,39.3 82,39.6 R14.1
  Bottom 0.254: v80,41.3 74.13,47.17 B1.16
D17  (via drill 0.35)
  Top 0.254: R16.1 84.78,40.52 v84,41.3
  Top 0.508: IC1.10 83.17,38.67 83.5,39 85.3,39 86,39.7 R16.1
  Bottom 0.254: v84,41.3 76.93,48.37 B1.17
D36
  Top 0.254: U$2.P$18 U$2.P$2
  Bottom 0.254: U$2.P$18 120,43.14 114.25,48.9 114.25,49.02 113.52,49.74 113.39,49.74 108.89,54.26 107.48,54.26 106.75,54.98 106.75,56.38 98.21,64.93 96.48,64.93 95.77,65.64 95.77,67.37 B1.36
D37
  Top 0.254: U$2.P$19 U$2.P$3
  Bottom 0.254: U$2.P$19 120,46.74 118.75,47.98 118.75,48.01 113.52,53.24 112.44,53.24 107.92,57.76 107.48,57.76 106.75,58.48 106.75,58.92 B1.37
D38
  Top 0.254: U$2.P$20 U$2.P$4
  Bottom 0.254: B1.38 95.27,71.23 96.48,70.01 98.55,70.01 108.32,60.24 108.52,60.24 111.75,57.01 111.75,54.98 112.48,54.26 114.25,54.26 U$2.P$20
D39
  Top 0.254: U$2.P$21 U$2.P$5
  Bottom 0.254: B1.39 98.38,71.23 105.72,63.89 108.37,63.89 111.75,60.51 111.75,58.48 112.48,57.76 114.25,57.76 U$2.P$21
D40
  Top 0.254: U$2.P$22 U$2.P$6
  Bottom 0.254: B1.40 95.27,73.77 96.48,72.55 97.63,72.55 105.89,64.29 109.45,64.29 112.48,61.26 114.25,61.26 U$2.P$22
D41
  Top 0.254: U$2.P$23 U$2.P$7
  Bottom 0.254: B1.41 106.06,64.7 114.3,64.7 U$2.P$23
D42
  Top 0.254: U$2.P$24 U$2.P$8
  Bottom 0.254: B1.42 95.27,76.31 96.48,75.09 99.81,75.09 107.5,67.4 115.5,67.4 120,62.9 U$2.P$24
D43
  Top 0.254: U$2.P$25 U$2.P$9
  Bottom 0.254: B1.43 102.39,76.31 107.7,71 115,71 U$2.P$25
D44
  Top 0.254: U$2.P$10 U$2.P$26
  Bottom 0.254: B1.44 95.27,78.85 96.52,77.6 106.8,77.6 107,77.8 114.3,77.8 118.6,73.5 118.6,72.54 120,71.14 U$2.P$26
D45
  Top 0.254: U$2.P$11 U$2.P$27
  Bottom 0.254: B1.45 105.45,78.85 106.09,78.21 115.19,78.21 120,73.4 U$2.P$27
D46
  Top 0.254: U$2.P$12 U$2.P$28
  Bottom 0.254: B1.46 95.27,81.39 96.48,80.17 105.83,80.17 107.3,78.7 118.3,78.7 120,77 U$2.P$28
D47
  Top 0.254: U$2.P$29 U$2.P$13
  Bottom 0.254: B1.47 118.61,81.39 U$2.P$29
D48
  Top 0.254: U$2.P$14 U$2.P$30
  Bottom 0.254: B1.48 95.77,82.61 97.5,82.61 98.1,82 118.5,82 U$2.P$30
D49
  Top 0.254: U$2.P$15 U$2.P$31
  Bottom 0.254: U$2.P$31 117.92,84.92 97.98,84.92 B1.49
DC  (via drill 0.35)
  Top 0.254: v99.8,100.5 108.1,100.5 108.9,101.3 113.78,101.3 J7.5
  Bottom 0.254: B1.A14 90.74,98 97.3,98 v99.8,100.5
DISPL_CS
  Top 0.254: J7.3 112.44,99.7 112.44,91.8 111.7,91.06 111.7,67.7 108.6,64.6 97.72,64.6 97.5,64.83 95.77,64.83 B1.34
G
  Top 0.254: Q2.4 99.91,109.41 101.28,110.78 R2.2
G1
  Top 0.254: Q1.4 114.41,115.12 R4.2
GND  (via drill 0.4)  (1 unrouted)
  Top 0.254: U$2.P$16 U$2.P$32
  Bottom 0.254: U$1.P$32 U$1.P$16
  other vias: 4,126 8,126 6,122 10,122 14,122 12,126 16,126 4,118 8,118 12,118 16,118 6,114 10,114 14,114 4,110 8,110 12,110 6,106 10,106 4,102 8,102 6,98 4,94 8,94 6,90 4,86 8,86 6,82 4,78 8,78 6,74 4,70 8,70 6,66 4,62 8,62 6,58 4,54 8,54 6,50 4,46 8,46 6,42 4,38 8,38 6,34 4,30 8,30 6,26 4,22 8,22 6,18 4,14 8,14 22,98 26,93 22,88 30,88 26,83 34,83 30,78 22,78 26,73 22,68 34,73 30,68 26,63 22,58 30,58 34,63 100,7 100,3 104,5 108,7 108,3 112,5 116,7 116,3 120,5 124,7 124,3 66,28 66,24 69,26 72,24 72,28 69,30 72,32 90,28 90,34 94,31 98,28 98,34 102,31 106,34 106,28 110,31 114,34 118,31 122,34 126,31 130,28 130,34 110.2,94.6 114.2,94.6 118.2,94.6 122.2,94.6 126.2,94.6 130.2,94.6 102,106 102,110 108,112 112,112 114,108 118,108 122,108 124,128 128,128 132,128 126,124 130,124 124,120 128,120 132,120 126,116 130,116 124,112 128,112 132,112 126,108 130,108 70,108 70,104 62,104 62,108 62,112 62,116 28,104 32,104 32,108 32,112 32,116 42,104 42,108 42,112 42,116 52,104 52,108 52,112 52,116
  pour Top (rank 4): 2.75,0.33 132,0.33 132.42,0.36 132.82,0.44 133.21,0.59 133.58,0.79 133.91,1.04 134.21,1.34 134.46,1.67 134.66,2.04 134.81,2.43 134.89,2.83 134.92,3.25 134.92,137.25 134.9,137.59 134.83,137.93 134.7,138.26 134.54,138.56 134.33,138.84 134.09,139.08 133.81,139.29 133.51,139.45 133.18,139.58 132.84,139.65 132.5,139.67 2.75,139.67 2.37,139.65 2,139.57 1.64,139.43 1.3,139.25 1,139.02 0.73,138.75 0.5,138.45 0.32,138.11 0.18,137.75 0.1,137.38 0.08,137 0.08,3 0.1,2.62 0.18,2.25 0.32,1.89 0.5,1.55 0.73,1.25 1,0.98 1.3,0.75 1.64,0.57 2,0.43 2.37,0.35
  pour Top (rank 2): 110.13,120.63 113.87,120.63 113.87,122.37 110.13,122.37
HEATER0-  (via drill 0.4)
  Top 0.508: LED1.C 84,116.25 | LED1.C 81.75,116.5 81.25,117 | LED1.C 83.75,114.75
  Top 2.54: J4.6 J4.5 81.25,118.41 81.25,117
  other vias: 97.5,112.5 96.25,111.25 95,112.5 93.75,111.25 92.5,112.5 91.25,111.25 90,112.5 88.75,111.25 87.5,112.5 86.25,111.25 85,112.5 83.75,111.25 80,115 81.25,113.75 82.5,112.5 77.5,115 75,115 76.25,113.75 75,112.5 78.75,113.75 80,112.5 81.25,111.25 77.5,112.5 78.75,111.25 80,110 76.25,111.25 77.5,110 78.75,108.75 80,107.5 75,110 76.25,108.75 75,107.5 77.5,107.5 76.25,106.25 78.75,106.25 75,105 77.5,105 80,105 75,102.5 76.25,103.75 77.5,102.5 78.75,103.75 80,102.5 81.25,103.75 82.5,102.5 83.75,103.5 85,102.5 86.5,103.5 87.5,102.5 88.75,103.5 90,102.5 91.25,103.5 92.5,102.5 93.75,103.5 95,102.5 96.25,103.5 97.5,102.5
  pour Top (no thermals): 82.99,114.94 82.96,114.95 82.45,115.46 82.44,115.49 82.44,116.97 81.97,117.44 74.03,117.44 73.56,116.97 73.56,100.78 74.03,100.31 97.97,100.31 98.44,100.78 98.44,104.47 97.97,104.94 87.49,104.94 87.46,104.95 87.45,104.96 87.44,104.99 87.44,110.01 87.45,110.04 87.46,110.05 87.49,110.06 99.47,110.06 99.94,110.53 99.94,114.47 99.47,114.94
  pour Bottom (no thermals): 74.03,100.08 98.67,100.08 99.02,100.43 99.02,117.12 98.47,117.67 74.03,117.67 73.58,117.22 73.58,100.53
HEATER1-  (via drill 0.4)
  Top 0.508: LED2.C 101,133
  Top 2.54: 102.5,133 101,133 97.3,133 J4.2 J4.1
  other vias: 107.5,117.5 105,117.5 106.25,118.75 105,120 107.5,120 106.25,121.25 105,122.5 107.5,122.5 106.25,123.75 105,125 107.5,125 106.25,126.25 105,127.5 107.5,127.5 106.25,128.75 105,130 105,132.5 107.5,132.5 110,132.5 112.5,132.5 115,132.5 117.5,132.5 106.25,131.25 107.5,130 108.75,128.75 108.75,131.25 110,130 111.25,131.25 112.5,130 113.75,131.25 115,130 116.25,131.25 117.5,130 116.25,128.75 117.5,127.5 116.25,126.25 117.5,125 116.25,123.75 117.5,122.5 116.25,121.25 117.5,120 116.25,118.75 117.5,117.5
  pour Top (no thermals): 115.06,122.44 115.08,122.41 115.08,115.53 115.53,115.08 119.47,115.08 119.92,115.53 119.92,134.47 119.47,134.93 103.03,134.93 102.58,134.47 102.58,115.53 103.03,115.08 109.47,115.08 109.92,115.53 109.92,122.41 109.94,122.44 109.96,122.46 109.99,122.47 115.01,122.47 115.04,122.46
  pour Bottom (isolate 0.254, no thermals): 103.03,115.08 119.47,115.08 119.92,115.53 119.92,134.47 119.47,134.92 103.03,134.92 102.58,134.47 102.58,115.53
IN0
  Top 0.508: J6.2 J6.1 70.55,20.8 71.8,20.8 74,23 R15.1
IN1
  Top 0.508: J6.4 J6.3 75.53,20.7 76.8,20.7 78,21.9 R17.1
IN2
  Top 0.508: J6.6 J6.5 80.41,20.5 81,20.5 82,21.5 R13.1
IN3
  Top 0.508: J6.8 J6.7 86,21.01 R19.1
LED  (via drill 0.35)
  Top 0.254: B1.A13 87.65,96.63 88.86,95.41 92.42,95.41 92.9,95.9 v100.7,95.9
  Bottom 0.254: v100.7,95.9 111.18,95.9 114.08,98.8 115.64,98.8 116.28,99.44 116.28,101 J7.8
N$1
  pour Bottom (rank 2): 3.25,-0.17 132,-0.17 132.42,-0.14 132.82,-0.06 133.21,0.09 133.58,0.29 133.91,0.54 134.21,0.84 134.46,1.17 134.66,1.54 134.81,1.93 134.89,2.33 134.92,2.75 134.92,136.75 134.89,137.17 134.81,137.57 134.66,137.96 134.46,138.33 134.21,138.66 133.91,138.96 133.58,139.21 133.21,139.41 132.82,139.56 132.42,139.64 132,139.67 2.75,139.67 2.37,139.65 2,139.57 1.64,139.43 1.3,139.25 1,139.02 0.73,138.75 0.5,138.45 0.32,138.11 0.18,137.75 0.1,137.38 0.08,137 0.08,3 0.11,2.55 0.2,2.11 0.36,1.68 0.58,1.28 0.85,0.92 1.17,0.6 1.53,0.33 1.93,0.11 2.36,-0.05 2.8,-0.14
N$3
  Top 0.508: R3.1 LED1.A
N$5
  Top 0.508: R5.1 LED2.A
N$100
  Top 0.508: R15.2 74,28.5 74.6,29.1 75.1,29.1 75.56,29.55 IC1.1
N$102
  Top 0.508: R17.2 78,30.66 IC1.3
N$104
  Top 0.508: R13.2 82,28 80.64,29.36 IC1.5
N$106
  Top 0.508: R19.2 86,27.8 84.9,28.9 83.9,28.9 83.17,29.62 IC1.7
N$130
  Top 0.508: Q3.1 56.3,111.17 55.77,110.65 R6.2
N$139
  Top 0.508: Q4.1 46.15,111.17 45.52,110.55 R10.2
N$141
  Top 0.508: Q5.1 36.05,111.16 35.52,110.62 R8.2
NC  (1 unrouted)
OUT0-
  Top 0.508: J5.7 55.76,116.56 | Q3.3 57.25,114.9 55.7,116.45 D1.2
  Top 0.813: 55.76,116.56 D1.2 | J5.8 J5.7
OUT1-
  Top 0.508: J5.11 45.6,116.65 | D2.2 45.45,115.47 47.1,113.83 Q4.3
  Top 0.813: 45.6,116.65 D2.2 | J5.11 J5.12
OUT2-
  Top 0.508: J5.15 D3.2 35.45,115.36 37.01,113.81 Q5.3
  Top 0.813: J5.16 J5.15
PWM0  (via drill 0.4)
  Top 0.254: U$1.P$2 U$1.P$18 99.02,41.5 92.82,47.7 92.82,48.08 90.4,50.5 v66.75,50.5
  Bottom 0.254: B1.0 66.1,50.5 v66.75,50.5
PWM1  (via drill 0.4)
  Top 0.254: U$1.P$3 U$1.P$19 96.1,45 93.23,47.87 93.23,48.67 90.15,51.75 v66.75,51.75
  Bottom 0.254: B1.1 64.81,51.75 v66.75,51.75
PWM2  (via drill 0.4)
  Top 0.254: U$1.P$4 U$1.P$20 98.58,48.5 97.5,49.59 93.51,49.59 90.1,53 v66.75,53
  Bottom 0.254: B1.2 63.52,53 v66.75,53
PWM3  (via drill 0.4)
  Top 0.254: U$1.P$5 U$1.P$21 97.62,52 97.5,52.13 93.97,52.13 91.85,54.25 v66.75,54.25
  Bottom 0.254: B1.3 62.23,54.25 v66.75,54.25
PWM4  (via drill 0.4)
  Top 0.254: U$1.P$6 U$1.P$22 98.22,55.5 97.5,54.77 93.94,54.77 93.22,55.5 v66.75,55.5
  Bottom 0.254: B1.4 60.94,55.5 v66.75,55.5
PWM5  (via drill 0.35)
  Top 0.254: v115.39,111.14 118.03,111.14 118.97,112.08 R4.1
  Bottom 0.254: v115.39,111.14 114.03,111.14 95.67,92.77 95.67,91.05 94.95,90.33 93.23,90.33 B1.5
PWM6  (via drill 0.35)
  Top 0.254: v105.8,109.8 105.8,111.38 R2.1
  Bottom 0.254: B1.6 69.6,69.24 70.87,69.24 93.23,91.6 93.23,92.06 95.87,94.69 96.72,94.69 105.8,103.77 v105.8,109.8
PWM7
  Top 0.254: R7.1 57.98,104.5 53.88,100.41 52.58,100.41 49.55,97.38 49.55,94.98 46.19,91.61 B1.7
  Top 0.508: R6.1 R7.1
PWM8
  Top 0.254: R9.2 48.12,104.15 48.12,95.62 42.13,89.63 B1.8
  Top 0.508: R10.1 R9.2
PWM9
  Top 0.254: B1.9 38.48,49.48 38.48,95 37.35,96.12 37.35,97.14 38.48,98.26 R11.1
  Top 0.508: R8.1 R11.1
RESET  (via drill 0.35)
  Top 0.254: v101.9,101.5 104.5,104.1 110.98,104.1 J7.4
  Bottom 0.254: B1.A15 97.03,96.63 v101.9,101.5
SCK  (via drill 0.4)
  Top 0.254: v30.75,45.5 31.5,46.25 64.5,46.25 65.25,47 | v65.25,40.75 65.25,47 | 65.25,47 65.5,47.25 65.5,68.75 85.76,89.01 B1.52 95.27,89.01 96.48,87.79 100.71,87.79 101.5,87 U$1.P$31
  Bottom 0.254: U$3.11 27.08,41.83 v30.75,45.5 | U$4.11 55.91,35.25 62,35.25 65.25,38.5 v65.25,40.75 | U$1.P$31 U$1.P$15 116.2,90.2 116.2,98.38 J7.7 118.82,101 119.3,101 120.26,101.96 J7.10
SPI_MISO  (via drill 0.35)
  Top 0.254: U$1.P$29 102.75,85.25 96.48,85.25 95.27,86.47 B1.50 84.77,86.47 v68,69.7 | U$1.P$13 117.2,84.2 117.2,96.84 J7.9
  Bottom 0.254: U$4.13 45.92,36 23.5,36 22,37.5 U$3.13 22,54.5 32,64.5 62.8,64.5 v68,69.7 | U$1.P$29 U$1.P$13 | J7.13 124.14,101.1 121.1,101.1 120.26,100.26 J7.9
SPI_MOSI  (via drill 0.4)
  Top 0.254: U$3.10 29.62,35.88 v31.25,34.25 | B1.51 105.03,86.47 U$1.P$30 | U$1.P$14 116.5,87 116.5,101.12 J7.6
  Bottom 0.254: U$4.10 55.62,37.38 56.75,36.25 61.25,36.25 63.75,38.75 63.75,45.75 67,49 | 67,49 79.25,61.25 79.25,73.58 90.92,85.25 96,85.25 96.99,86.24 B1.51 | v31.25,34.25 62.5,34.25 67,38.75 67,49 | U$1.P$30 U$1.P$14 | J7.6 116.31,103.57 121.67,103.57 J7.12
STEP1_1A
  Top 1.27: J2.2 J2.1 16,19.5 19.5,23 19.5,25.34 U$3.3
STEP1_1B
  Top 1.27: J2.4 J2.3 21.08,21.08 22,22 U$3.4
STEP1_2A
  Top 1.27: J2.6 J2.5 26.16,20.34 24.5,22 24.5,25.34 U$3.5
STEP1_2B
  Top 1.27: U$3.6 27.25,25.21 27.25,23.99 31.24,20 J2.7 J2.8
STEP2_1A
  Top 1.27: J1.2 J1.1 42,19.5 45.5,23 45.5,25.34 U$4.3
STEP2_1B
  Top 1.27: J1.4 J1.3 47.08,21.08 48,22 U$4.4
STEP2_2A
  Top 1.27: J1.6 J1.5 52.16,20.34 50.5,22 50.5,25.34 U$4.5
STEP2_2B
  Top 1.27: U$4.6 53.08,23.92 57.25,19.75 J1.7 J1.8
T_CS
  Top 0.254: B1.33 97.29,63.91 113.61,63.91 118.2,68.5 118.2,93.4 122.8,98 J7.11
TEMP+
  Top 0.254: B1.A0 51.27,98.02 53,99.75 62,99.75 67.5,105.25 C1.1
  Top 0.508: C1.1 69.1,113.6 69.5,114 69.5,116 69.97,116.47 R1.1 71.5,121.5 J5.1 J5.2
TEMP-
  Top 0.508: C1.2 67.5,120.42 J5.3 J5.4

### Text on the board
tPlace: GND | GND | SCK | D49 | MOSI | D48 | MISO | D47 | A7 | D46 | A6 | D45 | A5 | D44 | A4 | D43 | A3 | D42 | A2 | D41 | ~D4 | D40 | ~D3 | D39 | ~D2 | D38 | ~D1 | D37 | ~D0 | D36 | 5V | 5V | mini-shield v1.0 rev B